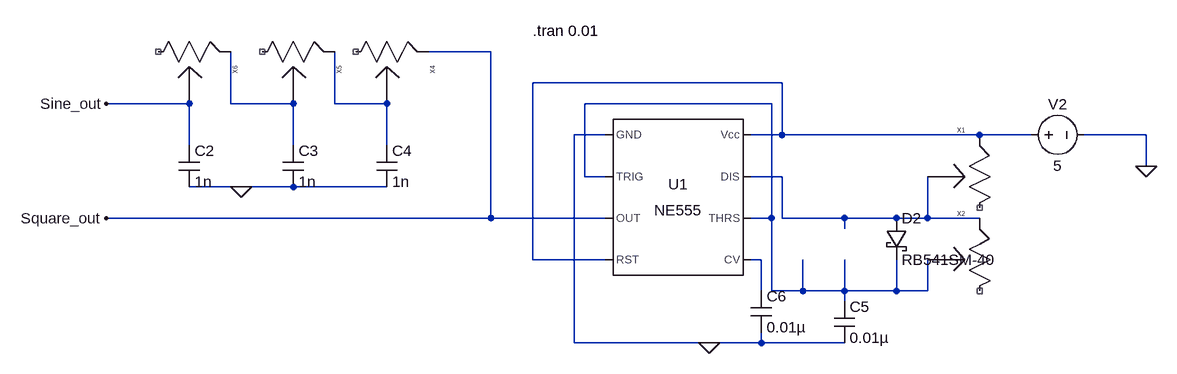
[diagram p0: schematic Task3.asc]
Task3.asc, the LTspice schematic file:
Version 4
SHEET 1 1636 680
WIRE 608 96 512 96
WIRE 1056 144 672 144
WIRE 144 176 16 176
WIRE 208 176 208 96
WIRE 304 176 208 176
WIRE 368 176 368 96
WIRE 448 176 368 176
WIRE 1040 176 752 176
WIRE 784 224 736 224
WIRE 1056 224 1056 144
WIRE 1056 224 1008 224
WIRE 1360 224 1056 224
WIRE 1440 224 1360 224
WIRE 1616 224 1520 224
WIRE 144 240 144 176
WIRE 304 240 304 176
WIRE 448 240 448 176
WIRE 1616 272 1616 224
WIRE 752 288 752 176
WIRE 784 288 752 288
WIRE 1056 288 1008 288
WIRE 224 304 144 304
WIRE 304 304 224 304
WIRE 448 304 304 304
WIRE 608 352 608 96
WIRE 608 352 16 352
WIRE 784 352 608 352
WIRE 1040 352 1040 176
WIRE 1040 352 1008 352
WIRE 1056 352 1056 288
WIRE 1152 352 1056 352
WIRE 1232 352 1152 352
WIRE 1280 352 1280 288
WIRE 1280 352 1232 352
WIRE 1360 352 1280 352
WIRE 1152 368 1152 352
WIRE 672 416 672 144
WIRE 784 416 672 416
WIRE 1024 416 1008 416
WIRE 1024 464 1024 416
WIRE 1040 464 1040 352
WIRE 1088 464 1088 416
WIRE 1088 464 1040 464
WIRE 1152 464 1152 416
WIRE 1152 464 1088 464
WIRE 1232 464 1232 416
WIRE 1232 464 1152 464
WIRE 1280 464 1280 416
WIRE 1280 464 1232 464
WIRE 1152 480 1152 464
WIRE 736 544 736 224
WIRE 944 544 736 544
WIRE 1024 544 1024 528
WIRE 1024 544 944 544
WIRE 1152 544 1024 544
FLAG 1616 272 0
FLAG 944 544 0
FLAG 224 304 0
FLAG 16 176 Sine_out
FLAG 16 352 Square_out
SYMBOL Misc\\NE555 896 320 R0
SYMATTR InstName U1
SYMBOL voltage 1424 224 R270
WINDOW 0 32 56 VTop 2
WINDOW 3 -32 56 VBottom 2
WINDOW 123 0 0 Left 0
WINDOW 39 0 0 Left 0
SYMATTR InstName V2
SYMATTR Value 5
SYMBOL cap 1136 480 R0
SYMATTR InstName C5
SYMATTR Value 0.01µ
SYMBOL cap 1008 464 R0
SYMATTR InstName C6
SYMATTR Value 0.01µ
SYMBOL cap 128 240 R0
SYMATTR InstName C2
SYMATTR Value 1n
SYMBOL cap 288 240 R0
SYMATTR InstName C3
SYMATTR Value 1n
SYMBOL cap 432 240 R0
SYMATTR InstName C4
SYMATTR Value 1n
SYMBOL potentiometer 1376 240 M0
SYMATTR InstName X1
SYMATTR SpiceLine R = 60k val = 99
SYMBOL potentiometer 1376 368 M0
SYMATTR InstName X2
SYMATTR SpiceLine R = 60k val =99
SYMBOL potentiometer 496 80 R90
SYMATTR InstName X4
SYMATTR SpiceLine R = 100k val = 99
SYMBOL potentiometer 352 80 R90
SYMATTR InstName X5
SYMATTR SpiceLine R = 100k val = 99
SYMBOL potentiometer 192 80 R90
SYMATTR InstName X6
SYMATTR SpiceLine R = 100k val = 99
SYMBOL schottky 1216 352 R0
SYMATTR InstName D2
SYMATTR Value RB541SM-40
SYMATTR Description Diode
SYMATTR Type diode
TEXT 672 64 Left 2 !.tran 0.01

The netlist it stands for:
* Task3.asc
XU1 0 N004 Square_out N001 N006 N004 N005 N001 NE555  ; pins GND TRIG OUT RST CV THRS DIS Vcc
V2 N001 0 5
C5 N004 0 0.01µ
C6 N006 0 0.01µ
C2 Sine_out 0 1n
C3 N002 0 1n
C4 N003 0 1n
XX1 N001 N005 NC_01 potentiometer R = 60k val = 99  ; pins A B C
XX2 N005 N004 NC_02 potentiometer R = 60k val =99  ; pins A B C
XX4 Square_out N003 NC_03 potentiometer R = 100k val = 99  ; pins A B C
XX5 N003 N002 NC_04 potentiometer R = 100k val = 99  ; pins A B C
XX6 N002 Sine_out NC_05 potentiometer R = 100k val = 99  ; pins A B C
D2 N005 N004 RB541SM-40
.model D D
.lib standard.dio
.tran 0.01
.lib NE555.sub
.backanno
.end